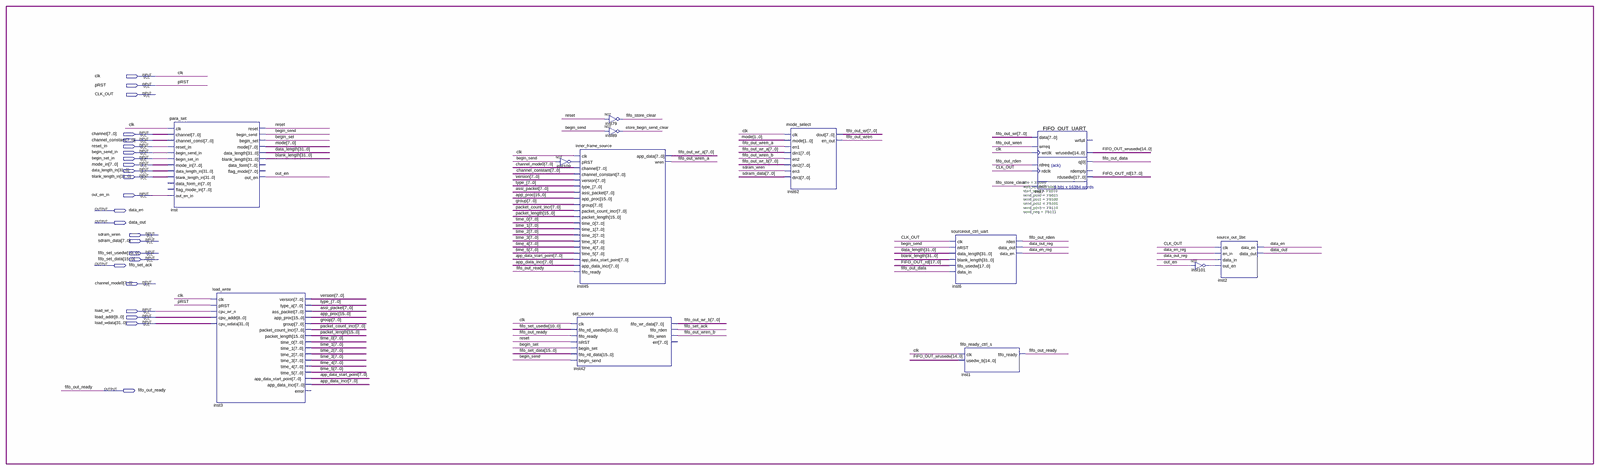
[diagram p0: schematic sheet, whole]
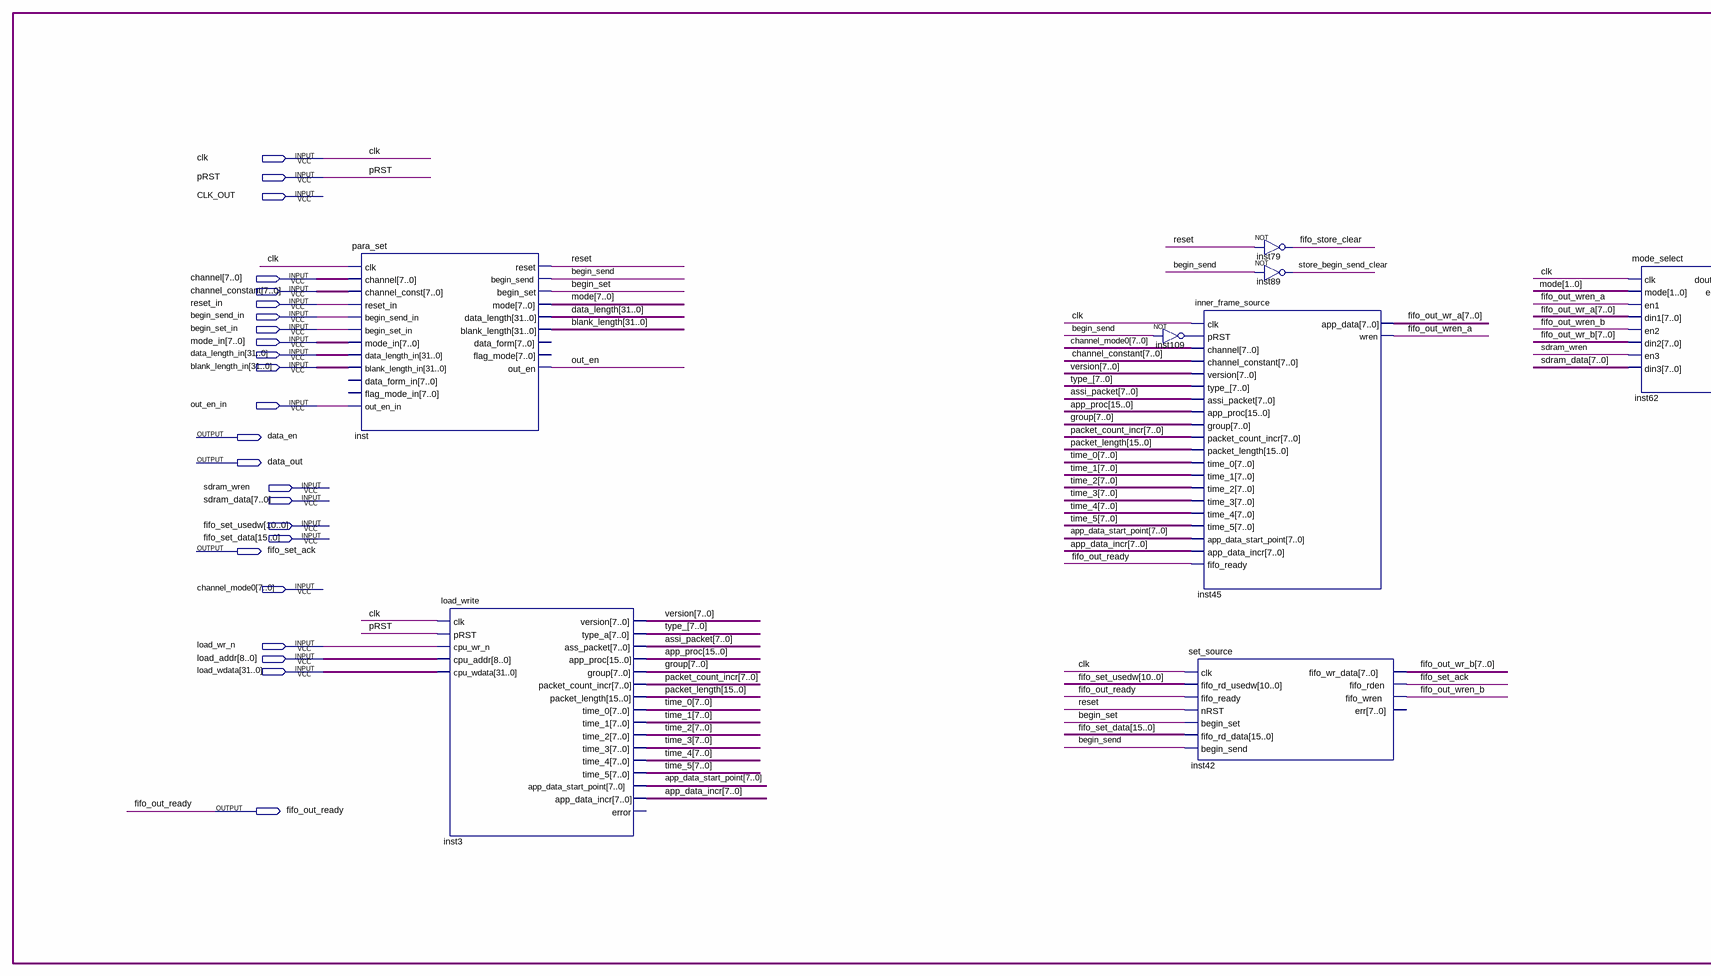
[diagram p1: schematic sheet, left part]
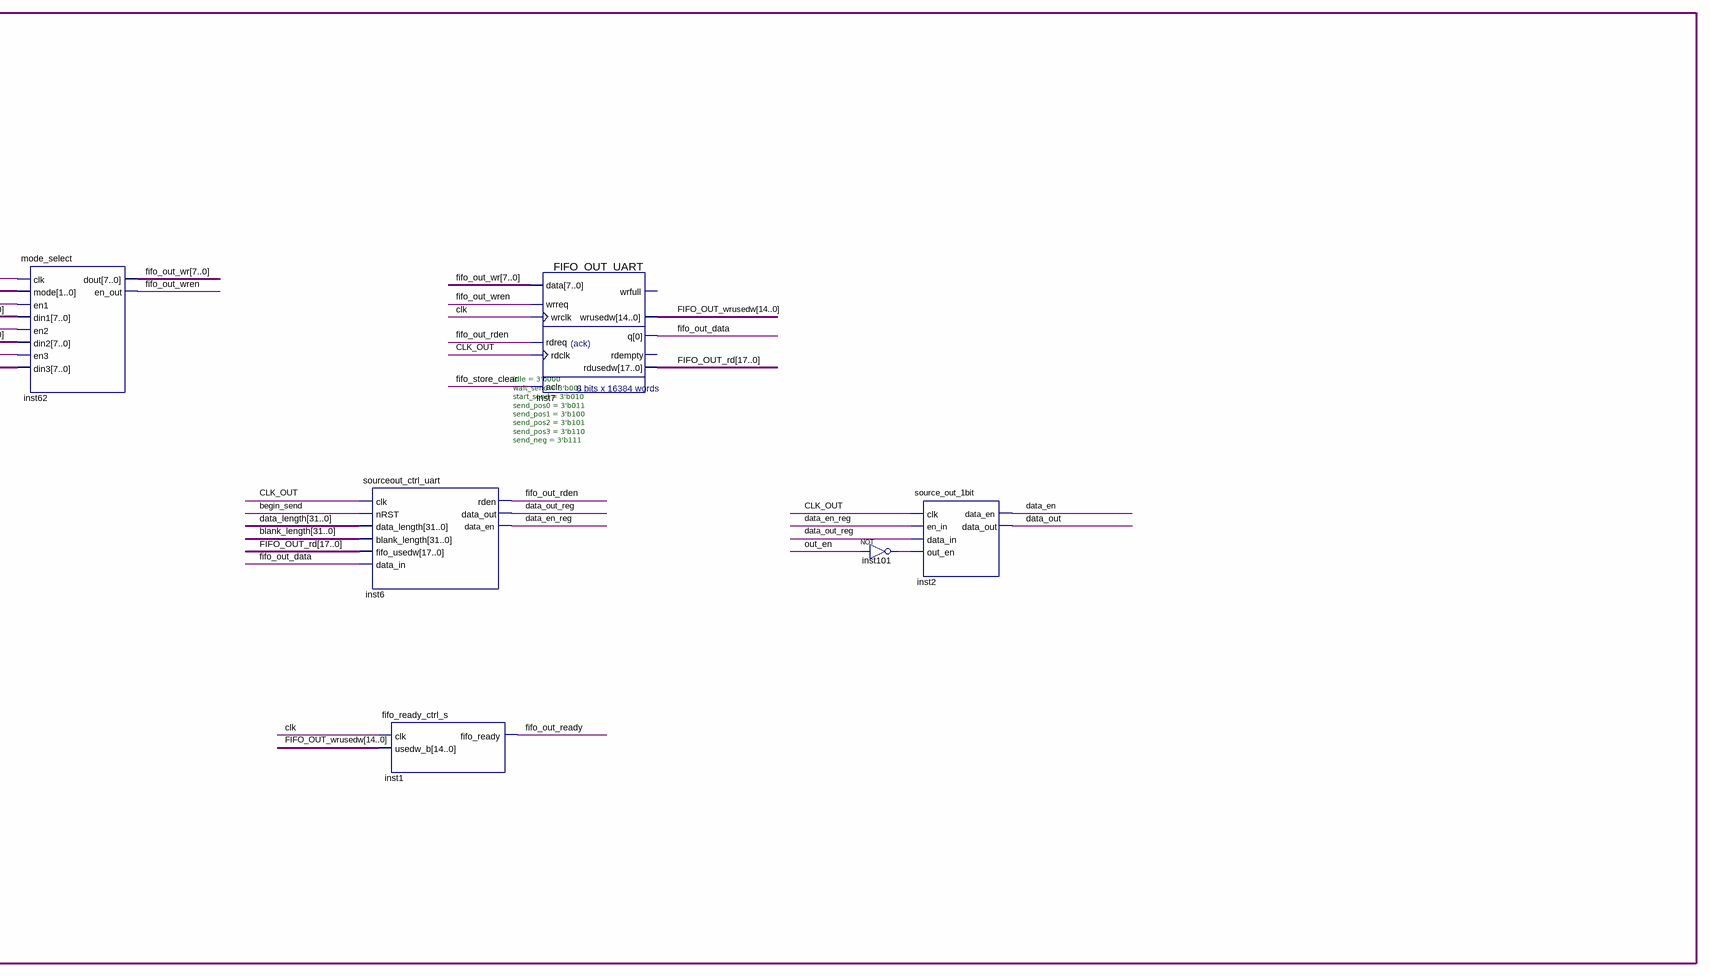
[diagram p2: schematic sheet, right part]
// Quartus schematic data_source_uart.bdf as structural Verilog: 13 symbols, 24 pins
module data_source_uart (
  input  clk,
  input  pRST,
  input  CLK_OUT,
  input  [7:0] channel,
  input  [7:0] channel_constant,
  input  reset_in,
  input  begin_send_in,
  input  begin_set_in,
  input  [7:0] mode_in,
  input  [31:0] data_length_in,
  input  [31:0] blank_length_in,
  input  out_en_in,
  input  sdram_wren,
  input  [7:0] sdram_data,
  input  [10:0] fifo_set_usedw,
  input  [15:0] fifo_set_data,
  input  [7:0] channel_mode0,
  input  load_wr_n,
  input  [8:0] load_addr,
  input  [31:0] load_wdata,
  output data_en,
  output data_out,
  output fifo_set_ack,
  output fifo_out_ready
);

  wire begin_send, begin_set, data_en_reg, data_out_reg, fifo_out_data, fifo_out_rden, fifo_out_wren,
       fifo_out_wren_a, fifo_out_wren_b, fifo_store_clear, inst101_out, inst109_out, out_en, reset,
       store_begin_send_clear;
  wire [7:0] app_data_incr, app_data_start_point, assi_packet, fifo_out_wr, fifo_out_wr_a, fifo_out_wr_b,
       group, mode, packet_count_incr, time_0, time_1, time_2, time_3, time_4, time_5, type_, version;
  wire [14:0] FIFO_OUT_wrusedw;
  wire [15:0] app_proc, packet_length;
  wire [17:0] FIFO_OUT_rd;
  wire [31:0] blank_length, data_length;

  para_set inst (
    .clk(clk), .channel(channel), .channel_const(channel_constant), .reset_in(reset_in),
    .begin_send_in(begin_send_in), .begin_set_in(begin_set_in), .mode_in(mode_in),
    .data_length_in(data_length_in), .blank_length_in(blank_length_in), .out_en_in(out_en_in), .reset(reset),
    .begin_send(begin_send), .begin_set(begin_set), .mode(mode), .data_length(data_length),
    .blank_length(blank_length), .out_en(out_en));  // open: data_form_in, flag_mode_in, data_form, flag_mode
  load_write inst3 (
    .clk(clk), .pRST(pRST), .cpu_wr_n(load_wr_n), .cpu_addr(load_addr), .cpu_wdata(load_wdata),
    .version(version), .type_a(type_), .ass_packet(assi_packet), .app_proc(app_proc), .group(group),
    .packet_count_incr(packet_count_incr), .packet_length(packet_length), .time_0(time_0), .time_1(time_1),
    .time_2(time_2), .time_3(time_3), .time_4(time_4), .time_5(time_5),
    .app_data_start_point(app_data_start_point), .app_data_incr(app_data_incr));  // open: error
  not inst109 (inst109_out, begin_send);
  inner_frame_source inst45 (
    .clk(clk), .pRST(inst109_out), .channel(channel_mode0), .channel_constant(channel_constant),
    .version(version), .type_(type_), .assi_packet(assi_packet), .app_proc(app_proc), .group(group),
    .packet_count_incr(packet_count_incr), .packet_length(packet_length), .time_0(time_0), .time_1(time_1),
    .time_2(time_2), .time_3(time_3), .time_4(time_4), .time_5(time_5),
    .app_data_start_point(app_data_start_point), .app_data_incr(app_data_incr), .fifo_ready(fifo_out_ready),
    .app_data(fifo_out_wr_a), .wren(fifo_out_wren_a));
  set_source inst42 (
    .clk(clk), .fifo_rd_usedw(fifo_set_usedw), .fifo_ready(fifo_out_ready), .nRST(reset),
    .begin_set(begin_set), .fifo_rd_data(fifo_set_data), .begin_send(begin_send),
    .fifo_wr_data(fifo_out_wr_b), .fifo_rden(fifo_set_ack), .fifo_wren(fifo_out_wren_b));  // open: err
  not inst79 (fifo_store_clear, reset);
  not inst89 (store_begin_send_clear, begin_send);
  mode_select inst62 (
    .clk(clk), .mode(mode[1:0]), .en1(fifo_out_wren_a), .din1(fifo_out_wr_a), .en2(fifo_out_wren_b),
    .din2(fifo_out_wr_b), .en3(sdram_wren), .din3(sdram_data), .dout(fifo_out_wr), .en_out(fifo_out_wren));
  sourceout_ctrl_uart #(.idle(3'b000), .wait_send(3'b001), .start_send(3'b010), .send_pos0(3'b011), .send_pos1(3'b100), .send_pos2(3'b101), .send_pos3(3'b110), .send_neg(3'b111)) inst6 (
    .clk(CLK_OUT), .nRST(begin_send), .data_length(data_length), .blank_length(blank_length),
    .fifo_usedw(FIFO_OUT_rd), .data_in(fifo_out_data), .rden(fifo_out_rden), .data_out(data_out_reg),
    .data_en(data_en_reg));
  fifo_ready_ctrl_s inst1 (.clk(clk), .usedw_b(FIFO_OUT_wrusedw), .fifo_ready(fifo_out_ready));
  FIFO_OUT_UART inst7 (
    .data(fifo_out_wr), .wrreq(fifo_out_wren), .wrclk(clk), .rdreq(fifo_out_rden), .rdclk(CLK_OUT),
    .aclr(fifo_store_clear), .wrusedw(FIFO_OUT_wrusedw), .q(fifo_out_data), .rdusedw(FIFO_OUT_rd));  // open: wrfull, rdempty
  not inst101 (inst101_out, out_en);
  source_out_1bit inst2 (
    .clk(CLK_OUT), .en_in(data_en_reg), .data_in(data_out_reg), .out_en(inst101_out), .data_en(data_en),
    .data_out(data_out));
endmodule
